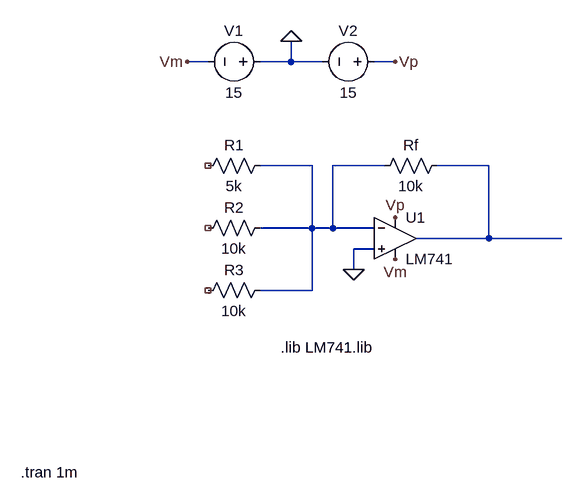
[diagram p0: schematic summingAmp.asc]
summingAmp.asc, the LTspice schematic file:
Version 4
SHEET 1 880 680
WIRE -80 -96 -112 -96
WIRE 48 -96 48 -128
WIRE 48 -96 0 -96
WIRE 96 -96 48 -96
WIRE 208 -96 176 -96
WIRE 80 64 0 64
WIRE 192 64 112 64
WIRE 352 64 272 64
WIRE 80 160 80 64
WIRE 80 160 0 160
WIRE 112 160 112 64
WIRE 112 160 80 160
WIRE 176 160 112 160
WIRE 352 176 352 64
WIRE 352 176 240 176
WIRE 464 176 352 176
WIRE 176 192 144 192
WIRE 144 224 144 192
WIRE 80 256 80 160
WIRE 80 256 0 256
FLAG 48 -128 0
FLAG -112 -96 Vm
FLAG 208 -96 Vp
FLAG 208 144 Vp
FLAG 208 208 Vm
FLAG 144 224 0
SYMBOL OpAmps\\opamp2 208 112 R0
SYMATTR InstName U1
SYMATTR Value LM741
SYMBOL voltage 16 -96 R90
WINDOW 0 -32 56 VBottom 2
WINDOW 3 32 56 VTop 2
WINDOW 123 0 0 Left 0
WINDOW 39 0 0 Left 0
SYMATTR InstName V1
SYMATTR Value 15
SYMBOL voltage 192 -96 R90
WINDOW 0 -32 56 VBottom 2
WINDOW 3 32 56 VTop 2
WINDOW 123 0 0 Left 0
WINDOW 39 0 0 Left 0
SYMATTR InstName V2
SYMATTR Value 15
SYMBOL res 288 48 R90
WINDOW 0 0 56 VBottom 2
WINDOW 3 32 56 VTop 2
SYMATTR InstName Rf
SYMATTR Value 10k
SYMBOL res 16 48 R90
WINDOW 0 0 56 VBottom 2
WINDOW 3 32 56 VTop 2
SYMATTR InstName R1
SYMATTR Value 5k
SYMBOL res 16 144 R90
WINDOW 0 0 56 VBottom 2
WINDOW 3 32 56 VTop 2
SYMATTR InstName R2
SYMATTR Value 10k
SYMBOL res 16 240 R90
WINDOW 0 0 56 VBottom 2
WINDOW 3 32 56 VTop 2
SYMATTR InstName R3
SYMATTR Value 10k
TEXT 32 344 Left 2 !.lib LM741.lib
TEXT -368 536 Left 2 !.tran 1m

The netlist it stands for:
* summingAmp.asc
XU1 0 N001 Vp Vm N002 LM741  ; pins In+ In- V+ V- OUT
V1 0 Vm 15
V2 Vp 0 15
Rf N002 N001 10k
R1 N001 NC_01 5k
R2 N001 NC_02 10k
R3 N001 NC_03 10k
.lib LM741.lib
.tran 1m
.backanno
.end